# EAGLE schematic TAG_connect (EAGLE 6.3)
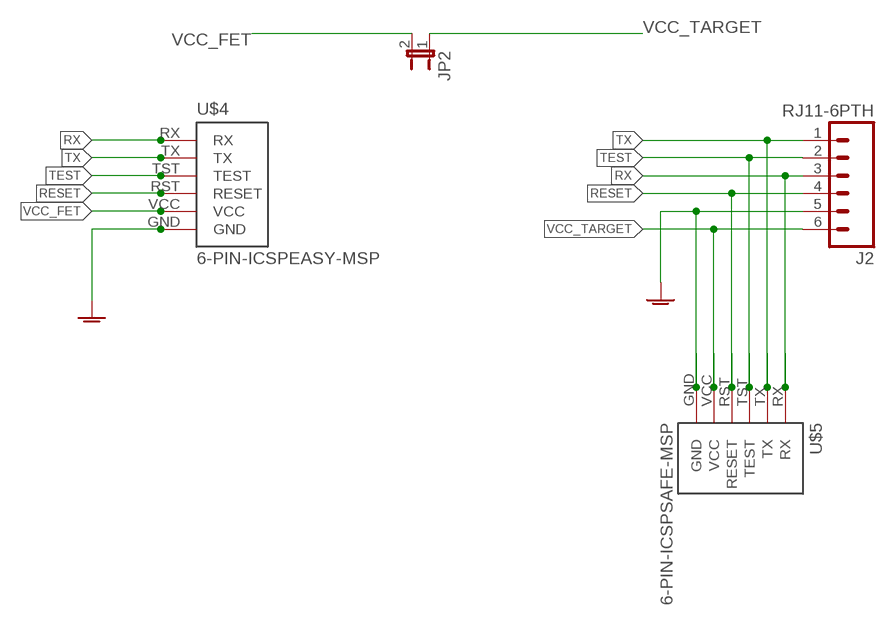
[diagram p0: schematic, sheet 1]

## Parts
J2  RJ11-6PTH  [RJ11-6]
JP2  JUMPER-2PTH_LOCK  [1X02_LOCK]
U$4  6-PIN-ICSPEASY-MSP  [EASYMSP-6PIN]
U$5  6-PIN-ICSPSAFE-MSP  [SAFEMSP-6PIN]

## Nets
GND: J2.5 U$4.GND U$5.GND
RESET: J2.4 U$4.RST(RESET) U$5.RST(RESET)
RX: J2.3 U$4.RX U$5.RX
TEST: J2.2 U$4.TST(TEST) U$5.TST(TEST)
TX: J2.1 U$4.TX U$5.TX
VCC_FET: JP2.2 U$4.VCC
VCC_TARGET: J2.6 JP2.1 U$5.VCC

## Library data of the parts
J2 = SparkFun-Connectors:RJ11-6: RJ11 Jack Simple 6 pin RJ11 jack. Commonly found on CAT3 devices and Microchip programmers. SKU: PRT-00132
JP2 = SparkFun-Passives:JUMPER-2: Jumper Basic 0.1" spaced jumper. Use with breakaway headers.
U$4 U$5 = LaunchFET:6-PIN-ICSP: 6 pin easy-msp formatted headers. Designed to make programming target boards with MSP430 Launchpad easier. EASYMSP: standard .05" pitch header to match launchpad SAFEMSP: .05" header with .025" offset Vcc to keep Geordi away